# EAGLE schematic Tiny-Door-and-Window-Sensor_v01_with-prog-features (EAGLE 7.3.0)
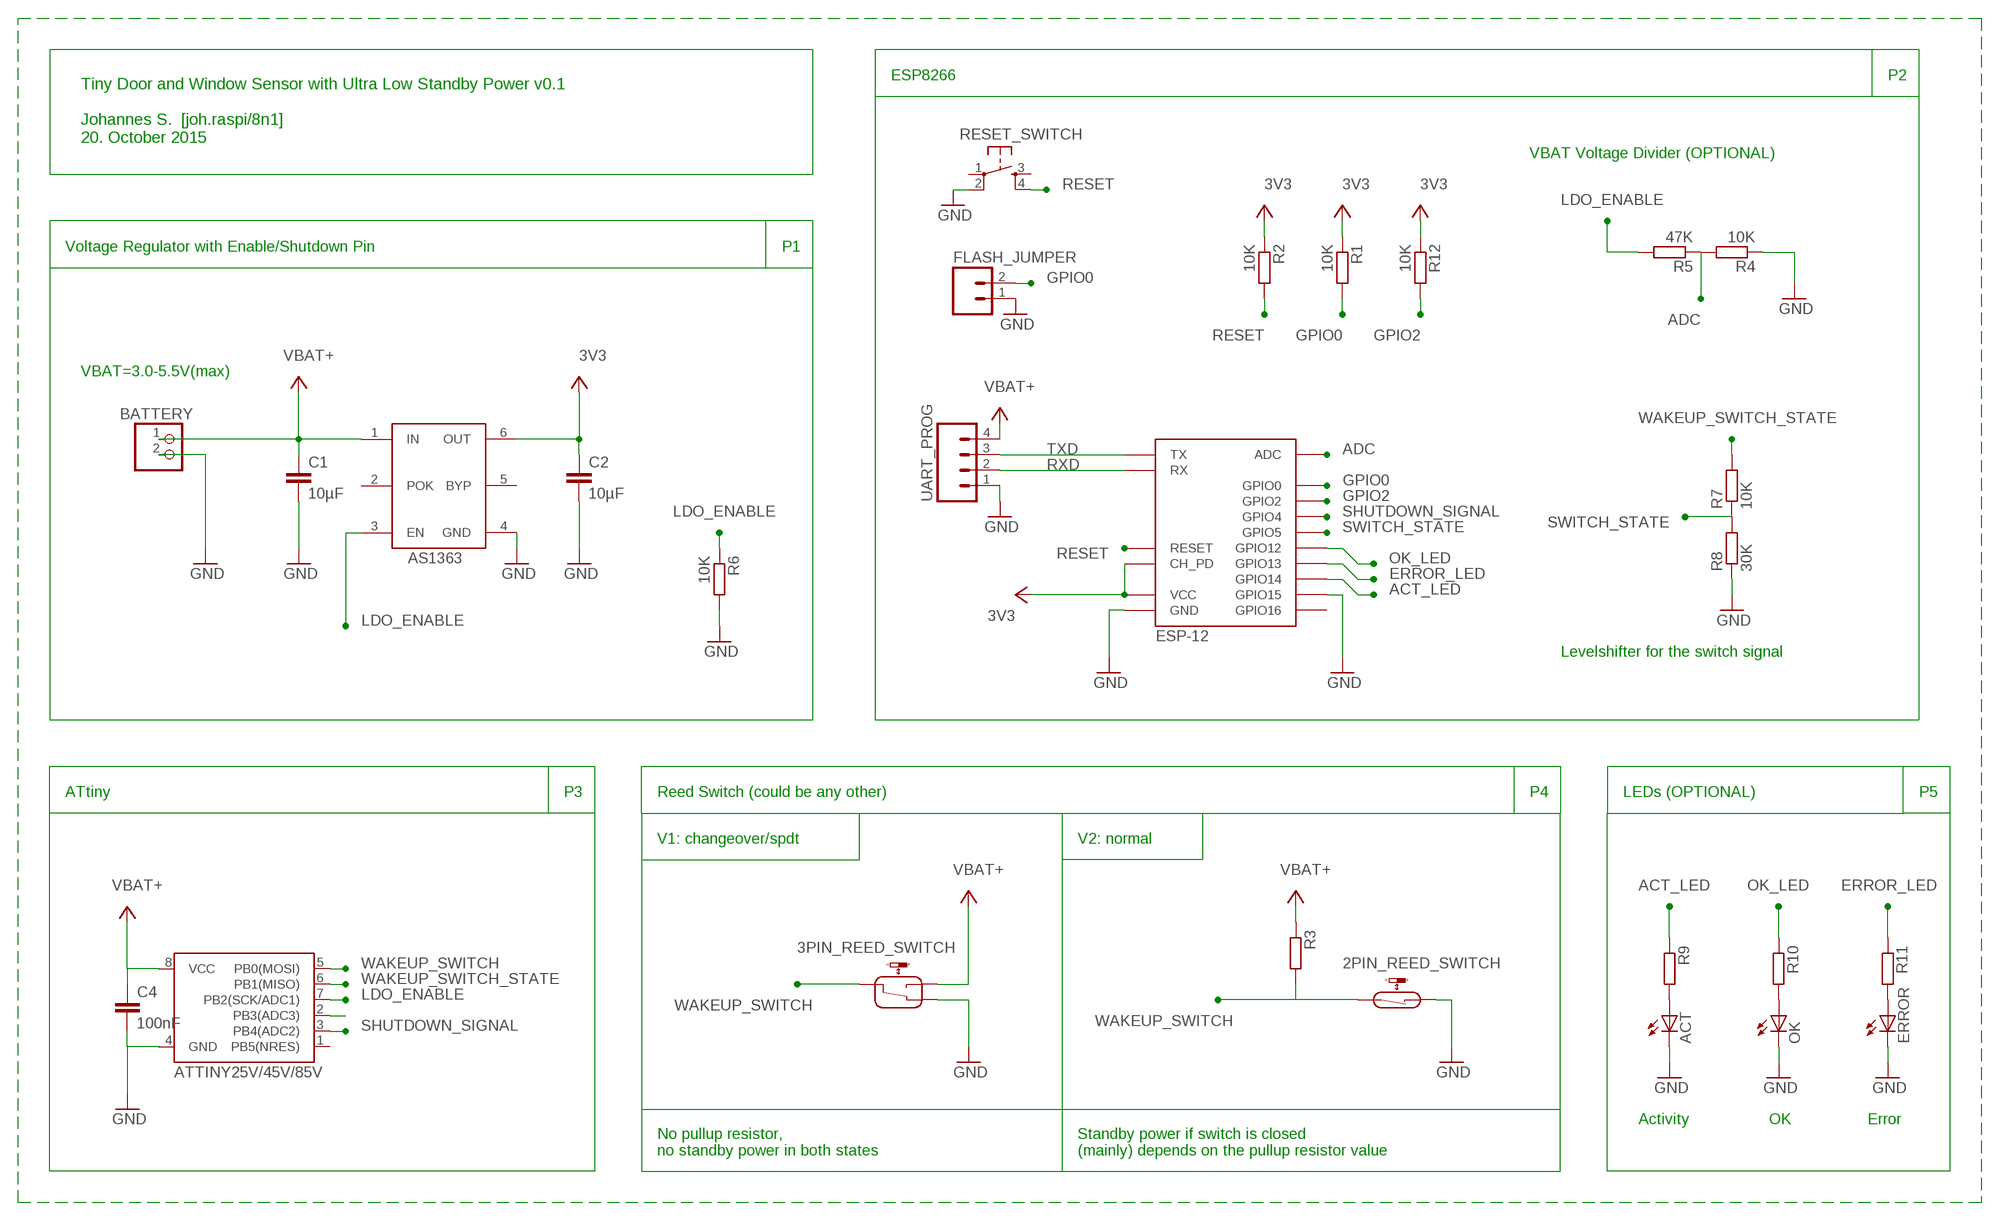
[diagram p0: schematic, sheet 1]

## Parts
2PIN_REED_SWITCH  REED-SWITCH-CT10-1530-G1  [CT10-G1]
3PIN_REED_SWITCH  REED-SWITCH-NO-NC  [MK6-8-C]
ACT  LEDSML0805  [SML0805]
BATTERY  HEADER-1X2  [1X02_OVAL]
C1  10µF  C-EUC0805  [C0805]
C2  10µF  C-EUC0805  [C0805]
C4  100nF  C-EUC0805  [C0805]
ERROR  LEDSML0805  [SML0805]
FLASH_JUMPER  M02PTH  [1X02]
IC1  AS1363  [SOT23-6]
OK  LEDSML0805  [SML0805]
R1  10K  R-EU_R0805  [R0805]
R2  10K  R-EU_R0805  [R0805]
R3  R-EU_R0805  [R0805]
R4  10K  R-EU_R0805  [R0805]
R5  47K  R-EU_R0805  [R0805]
R6  10K  R-EU_R0805  [R0805]
R7  10K  R-EU_R0805  [R0805]
R8  30K  R-EU_R0805  [R0805]
R9  R-EU_R0805  [R0805]
R10  R-EU_R0805  [R0805]
R11  R-EU_R0805  [R0805]
R12  10K  R-EU_R0805  [R0805]
RESET_SWITCH  TACTILE-SWITCH-PTH  [TAC-SWITCH-PTH]
U$2  ATTINY25V/45V/85V  ATTINY13SOIC  [SO08]
U$3  ESP-12  [ESP-12]
UART_PROG  M04PTH  [1X04]

## Nets
3V3: C2.1 IC1.6(OUT) R1.1 R2.1 R12.1 U$3.CH_PD U$3.VCC ; supply symbol labelled VCC
ACT_LED: R9.1 U$3.GPIO14
ADC: R4.2 R5.1 U$3.ADC
ERROR_LED: R11.1 U$3.GPIO13
GND: 2PIN_REED_SWITCH.1 3PIN_REED_SWITCH.NC ACT.C BATTERY.2 C1.2 C2.2 C4.2 ERROR.C FLASH_JUMPER.1 IC1.4(GND) OK.C R4.1 R6.2 R8.1 RESET_SWITCH.2 U$2.4(GND) U$3.GND U$3.GPIO15 UART_PROG.1
GPIO0: FLASH_JUMPER.2 R1.2 U$3.GPIO0
GPIO2: R12.2 U$3.GPIO2
LDO_ENABLE: IC1.3(EN) R5.2 R6.1 U$2.7(PB2(SCK/ADC1))
N$8: ACT.A R9.2
N$10: OK.A R10.2
N$11: ERROR.A R11.2
OK_LED: R10.1 U$3.GPIO12
RESET: R2.2 RESET_SWITCH.4 U$3.RESET
RXD: U$3.RX UART_PROG.2
SHUTDOWN_SIGNAL: U$2.3(PB4(ADC2)) U$3.GPIO4
SWITCH_STATE: R7.1 R8.2 U$3.GPIO5
TIMER_RESET: U$2.2(PB3(ADC3))
TXD: U$3.TX UART_PROG.3
VBAT+: 3PIN_REED_SWITCH.NO BATTERY.1 C1.1 C4.1 IC1.1(IN) R3.1 U$2.8(VCC) UART_PROG.4 ; supply symbol labelled VCC
WAKEUP_SWITCH: 2PIN_REED_SWITCH.2 3PIN_REED_SWITCH.COM R3.2 U$2.5(PB0(MOSI))
WAKEUP_SWITCH_STATE: R7.2 U$2.6(PB1(MISO))
Unconnected: IC1.2(POK) RESET_SWITCH.1 RESET_SWITCH.3 U$2.1(PB5(NRES)) U$3.GPIO16

## Notes on the sheet
- ESP8266 | P2
- Tiny Door and Window Sensor with Ultra Low Standby Power v0.1
  
  Johannes S.  [joh.raspi/8n1]
  20. October 2015
- VBAT Voltage Divider (OPTIONAL)
- Voltage Regulator with Enable/Shutdown Pin | P1
- VBAT=3.0-5.5V(max)
- Levelshifter for the switch signal
- ATtiny | P3 | Reed Switch (could be any other) | P4 | LEDs (OPTIONAL) | P5
- V1: changeover/spdt | V2: normal
- Activity | OK | Error
- No pullup resistor, 
  no standby power in both states
- Standby power if switch is closed 
  (mainly) depends on the pullup resistor value

## Power pins joined to a net without a drawn wire
BYP: IC1.5(BYP)

## Library data of the parts
2PIN_REED_SWITCH = switch-reed:REED-SWITCH-: Reed Sensor; MF: COTO TECHNOLOGY; MPN: CT10-1530-G1; OC_FARNELL: 1081696
3PIN_REED_SWITCH = switch-reed:REED-SWITCH-NO-NC: Reed Sensor NO NC
ACT ERROR OK = led:LED: LED OSRAM: - CHIPLED LG R971, LG N971, LY N971, LG Q971, LY Q971, LO R971, LY R971 LH N974, LH R974 LS Q976, LO Q976, LY Q976 LO Q996 - Hyper CHIPLED LW Q18S LB Q993, LB Q99A, LB R99A - SideLED LS A670, LO A670, LY A670, LG A670, LP A670 LB A673, LV A673, LT A673, LW A673 LH A674 LY A675 LS A676, LA A676, LO A676, LY A676, LW A676 LS A679, LY A679, LG A679 - Hyper Micro SIDELED® LS Y876, LA Y876, LO Y876, LY Y876 LT Y87S - SmartLED LW L88C, LW L88S LB L89C, LB L89S, LG L890 LS L89K, LO L89K, LY L89K LS L896, LA L896, LO L896, LY L896 - TOPLED LS T670, LO T670, LY T670, LG T670, LP T670 LSG T670, LSP T670, LSY T670, LOP T670, LYG T670 LG T671, LOG T671, LSG T671 LB T673, LV T673, LT T673, LW T673 LH T674 LS T676, LA T676, LO T676, LY T676, LB T676, LH T676, LSB T676, LW T676 LB T67C, LV T67C, LT T67C, LS T67K, LO T67K, LY T67K, LW E67C LS E67B, LA E67B, LO E67B, LY E67B, LB E67C, LV E67C, LT E67C LW T67C LS T679, LY T679, LG T679 LS T770, LO T770, LY T770, LG T770, LP T770 LB T773, LV T773, LT T773, LW T773 LH T774 LS E675, LA E675, LY E675, LS T675 LS T776, LA T776, LO T776, LY T776, LB T776 LHGB T686 LT T68C, LB T68C - Hyper Mini TOPLED® LB M676 - Mini TOPLED Santana® LG M470 LS M47K, LO M47K, LY M47K Source: http://www.osram.convergy.de LUXEON: - LUMILED® LXK2-PW12-R00, LXK2-PW12-S00, LXK2-PW14-U00, LXK2-PW14-V00 LXK2-PM12-R00, LXK2-PM12-S00, LXK2-PM14-U00 LXK2-PE12-Q00, LXK2-PE12-R00, LXK2-PE12-S00, LXK2-PE14-T00, LXK2-PE14-U00 LXK2-PB12-K00, LXK2-PB12-L00, LXK2-PB12-M00, LXK2-PB14-N00, LXK2-PB14-P00, LXK2-PB14-Q00 LXK2-PR12-L00, LXK2-PR12-M00, LXK2-PR14-Q00, LXK2-PR14-R00 LXK2-PD12-Q00, LXK2-PD12-R00, LXK2-PD12-S00 LXK2-PH12-R00, LXK2-PH12-S00 LXK2-PL12-P00, LXK2-PL12-Q00, LXK2-PL12-R00 Source: www.luxeon.com KINGBRIGHT: KA-3528ASYC Source: www.kingbright.com
BATTERY = microbuilder:HEADER-1X2: PIN HEADER
C1 C2 C4 = resistor:C-EU: CAPACITOR, European symbol
FLASH_JUMPER = SparkFun:M02: Header 2 Standard 2-pin 0.1" header. Use with straight break away headers (SKU : PRT-00116), right angle break away headers (PRT-00553), swiss pins (PRT-00743), machine pins (PRT-00117), and female headers (PRT-00115). Molex polarized connector foot print use with SKU : PRT-08233 with associated crimp pins and housings.
IC1 = joh_as1363:AS1363: 500mA ultra-low-dropout linear regulator 1.2V-5V 40µA quiescen current Source: http://ams.com/eng/content/download/12507/219217/12422
R1-R12 = resistor:R-EU_: RESISTOR, European symbol
RESET_SWITCH = GeekAmmo:TACTILE-SWITCH: Tactile Switch 4 Pins, SPST NO
U$2 = SparkFun:ATTINY13
U$3 = johs_esp8266_lib_frank_esp12e_mod:ESP-12: ESP8266 Wifi Module ESP-12; DIMENSIONS: 24.0 x 16.0 mm; PINS: 16; PITCH: 0.078" / 2 mm
UART_PROG = SparkFun:M04: Header 4 Standard 4-pin 0.1" header. Use with straight break away headers (SKU : PRT-00116), right angle break away headers (PRT-00553), swiss pins (PRT-00743), machine pins (PRT-00117), and female headers (PRT-00115). Molex polarized connector foot print use with SKU : PRT-08231 with associated crimp pins and housings. 1MM SMD Version SKU: PRT-10208